# Altium schematic sheet In-Out.SchDoc
size A4; DocumentNumber: 7; SheetNumber: 7; SheetTotal: 7
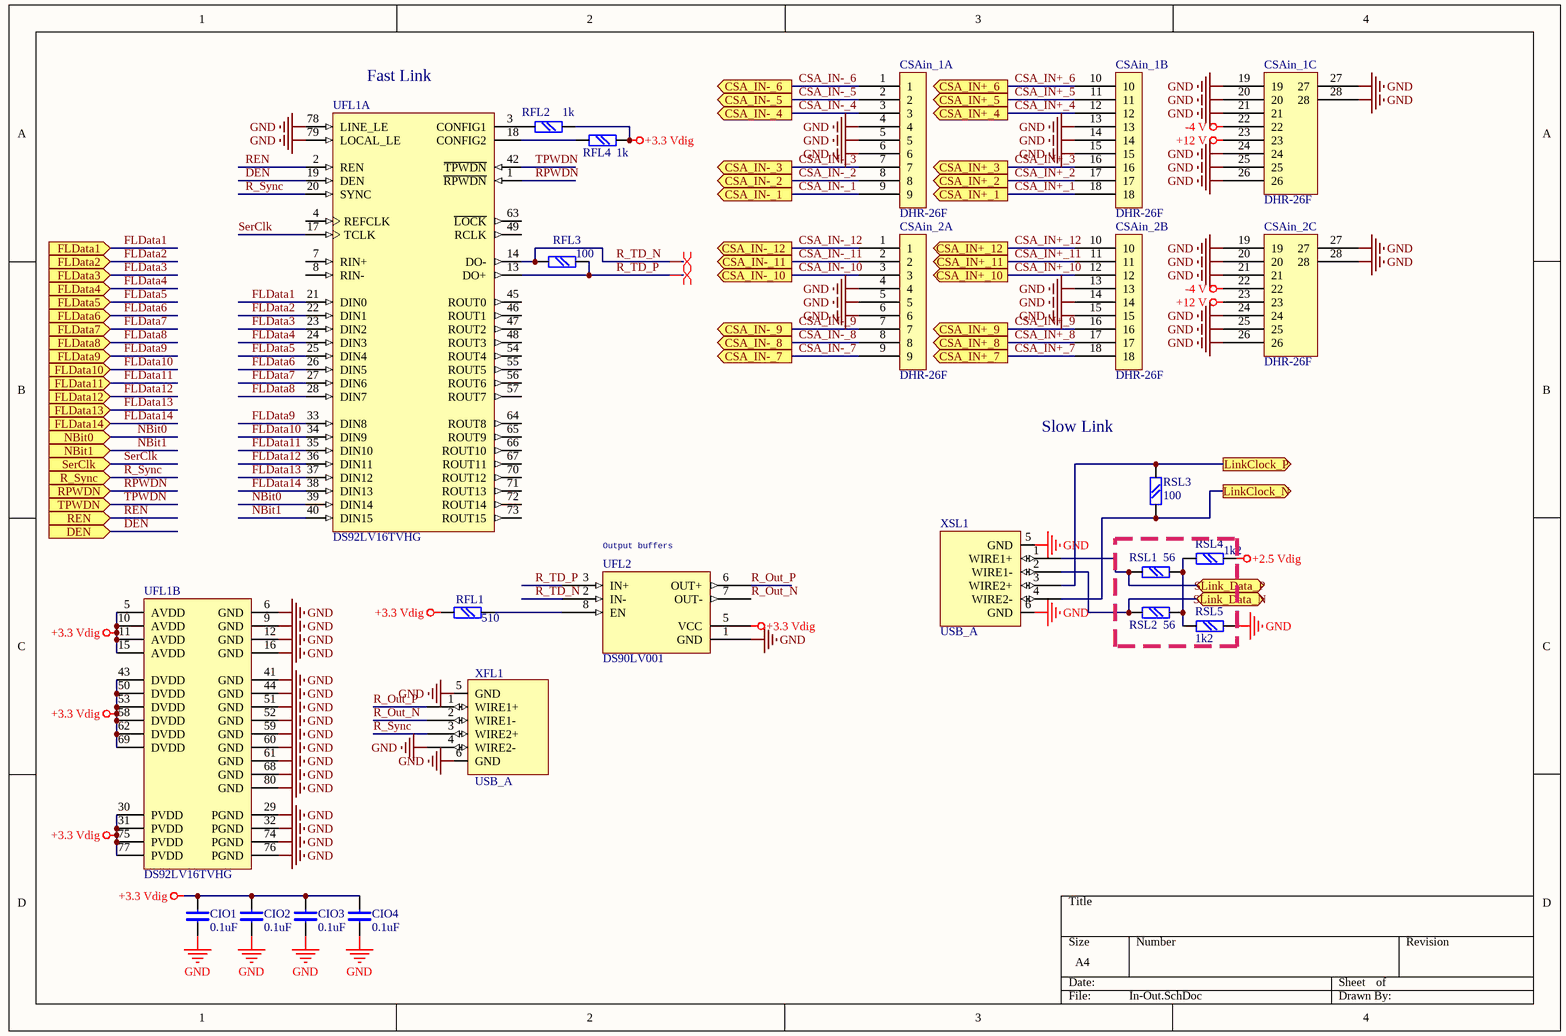
[diagram p0: In-Out.SchDoc]

## Parts
CIO1  0.1uF  [chip0603]
CIO2  0.1uF  [chip0603]
CIO3  0.1uF  [chip0603]
CIO4  0.1uF  [chip0603]
CSAin_1  DHR-26F  [DHR-F-26]  (parts A,B,C of 3)
CSAin_2  DHR-26F  [DHR-F-26]  (parts A,B,C of 3)
RFL1  510  [chip0603]
RFL2  1k  [chip0603]
RFL3  100  [chip0603]
RFL4  1k  [chip0603]
RSL1  56  [chip0603]
RSL2  56  [chip0603]
RSL3  100  [chip0603]
RSL4  1k2  [chip0603]
RSL5  1k2  [chip0603]
UFL1  DS92LV16TVHG  [VHG80A_N]  (parts A,B of 2)
UFL2  DS90LV001  [8SO200]
XFL1  USB_A  [USB2.5-2H4B]
XSL1  USB_A  [USB2.5-2H4B]

## Ports
CSA_IN+_1 (out), CSA_IN+_2 (out), CSA_IN+_3 (out), CSA_IN+_4 (out), CSA_IN+_5 (out), CSA_IN+_6 (out), CSA_IN+_7 (out), CSA_IN+_8 (out), CSA_IN+_9 (out), CSA_IN+_10 (out), CSA_IN+_11 (out), CSA_IN+_12 (out), CSA_IN-_1 (out), CSA_IN-_2 (out), CSA_IN-_3 (out), CSA_IN-_4 (out), CSA_IN-_5 (out), CSA_IN-_6 (out), CSA_IN-_7 (out), CSA_IN-_8 (out), CSA_IN-_9 (out), CSA_IN-_10 (out), CSA_IN-_11 (out), CSA_IN-_12 (out), DEN (in), FLData1 (in), FLData2 (in), FLData3 (in), FLData4 (in), FLData5 (in), FLData6 (in), FLData7 (in), FLData8 (in), FLData9 (in), FLData10 (in), FLData11 (in), FLData12 (in), FLData13 (in), FLData14 (in), LinkClock_N (out), LinkClock_P (out), NBit0 (in), NBit1 (in), R_Sync (in), REN (in), RPWDN (in), SerClk (in), SLink_Data_N (bidir), SLink_Data_P (bidir), TPWDN (in)

## Nets
+2.5 Vdig: RSL4.2
+3.3 Vdig: CIO1.2 CIO2.2 CIO3.2 CIO4.2 RFL1.1 RFL2.2 RFL4.2 UFL1.5(AVDD) UFL1.10(AVDD) UFL1.11(AVDD) UFL1.15(AVDD) UFL1.30(PVDD) UFL1.31(PVDD) UFL1.43(DVDD) UFL1.50(DVDD) UFL1.53(DVDD) UFL1.58(DVDD) UFL1.62(DVDD) UFL1.69(DVDD) UFL1.75(PVDD) UFL1.77(PVDD) UFL2.5(VCC)
+12 V: CSAin_1.23 CSAin_2.23
-4 V: CSAin_1.22 CSAin_2.22
GND: CIO1.1 CIO2.1 CIO3.1 CIO4.1 CSAin_1.4 CSAin_1.5 CSAin_1.6 CSAin_1.13 CSAin_1.14 CSAin_1.15 CSAin_1.19 CSAin_1.20 CSAin_1.21 CSAin_1.24 CSAin_1.25 CSAin_1.26 CSAin_1.27 CSAin_1.28 CSAin_2.4 CSAin_2.5 CSAin_2.6 CSAin_2.13 CSAin_2.14 CSAin_2.15 CSAin_2.19 CSAin_2.20 CSAin_2.21 CSAin_2.24 CSAin_2.25 CSAin_2.26 CSAin_2.27 CSAin_2.28 RSL5.1 UFL1.6(GND) UFL1.9(GND) UFL1.12(GND) UFL1.16(GND) UFL1.29(PGND) UFL1.32(PGND) UFL1.41(GND) UFL1.44(GND) UFL1.51(GND) UFL1.52(GND) UFL1.59(GND) UFL1.60(GND) UFL1.61(GND) UFL1.68(GND) UFL1.74(PGND) UFL1.76(PGND) UFL1.78(LINE_LE) UFL1.79(LOCAL_LE) UFL1.80(GND) UFL2.1(GND) XFL1.4(WIRE2-) XFL1.5(GND) XFL1.6(GND) XSL1.5(GND) XSL1.6(GND)
CSA_IN+_1: CSAin_1.18 ; port CSA_IN+_1
CSA_IN+_2: CSAin_1.17 ; port CSA_IN+_2
CSA_IN+_3: CSAin_1.16 ; port CSA_IN+_3
CSA_IN+_4: CSAin_1.12 ; port CSA_IN+_4
CSA_IN+_5: CSAin_1.11 ; port CSA_IN+_5
CSA_IN+_6: CSAin_1.10 ; port CSA_IN+_6
CSA_IN+_7: CSAin_2.18 ; port CSA_IN+_7
CSA_IN+_8: CSAin_2.17 ; port CSA_IN+_8
CSA_IN+_9: CSAin_2.16 ; port CSA_IN+_9
CSA_IN+_10: CSAin_2.12 ; port CSA_IN+_10
CSA_IN+_11: CSAin_2.11 ; port CSA_IN+_11
CSA_IN+_12: CSAin_2.10 ; port CSA_IN+_12
CSA_IN-_1: CSAin_1.9 ; port CSA_IN-_1
CSA_IN-_2: CSAin_1.8 ; port CSA_IN-_2
CSA_IN-_3: CSAin_1.7 ; port CSA_IN-_3
CSA_IN-_4: CSAin_1.3 ; port CSA_IN-_4
CSA_IN-_5: CSAin_1.2 ; port CSA_IN-_5
CSA_IN-_6: CSAin_1.1 ; port CSA_IN-_6
CSA_IN-_7: CSAin_2.9 ; port CSA_IN-_7
CSA_IN-_8: CSAin_2.8 ; port CSA_IN-_8
CSA_IN-_9: CSAin_2.7 ; port CSA_IN-_9
CSA_IN-_10: CSAin_2.3 ; port CSA_IN-_10
CSA_IN-_11: CSAin_2.2 ; port CSA_IN-_11
CSA_IN-_12: CSAin_2.1 ; port CSA_IN-_12
DEN: UFL1.19(DEN) ; port DEN
FLData1: UFL1.21(DIN0) ; port FLData1
FLData2: UFL1.22(DIN1) ; port FLData2
FLData3: UFL1.23(DIN2) ; port FLData3
FLData4: UFL1.24(DIN3) ; port FLData4
FLData5: UFL1.25(DIN4) ; port FLData5
FLData6: UFL1.26(DIN5) ; port FLData6
FLData7: UFL1.27(DIN6) ; port FLData7
FLData8: UFL1.28(DIN7) ; port FLData8
FLData9: UFL1.33(DIN8) ; port FLData9
FLData10: UFL1.34(DIN9) ; port FLData10
FLData11: UFL1.35(DIN10) ; port FLData11
FLData12: UFL1.36(DIN11) ; port FLData12
FLData13: UFL1.37(DIN12) ; port FLData13
FLData14: UFL1.38(DIN13) ; port FLData14
LinkClock_N: RSL3.1 XSL1.4(WIRE2-) ; port LinkClock_N
LinkClock_P: RSL3.2 XSL1.3(WIRE2+) ; port LinkClock_P
NBit0: UFL1.39(DIN14) ; port NBit0
NBit1: UFL1.40(DIN15) ; port NBit1
R_Out_N: UFL2.7(OUT-) XFL1.2(WIRE1-)
R_Out_P: UFL2.6(OUT+) XFL1.1(WIRE1+)
R_Sync: UFL1.20(SYNC) XFL1.3(WIRE2+) ; port R_Sync
R_TD_N: RFL3.1 UFL1.14(DO-) UFL2.2(IN-)
R_TD_P: RFL3.2 UFL1.13(DO+) UFL2.3(IN+)
REN: UFL1.2(REN) ; port REN
RPWDN: UFL1.1(~{RPWDN}) ; port RPWDN
SerClk: UFL1.17(TCLK) ; port SerClk
SLink_Data_N: RSL2.2 XSL1.2(WIRE1-) ; port SLink_Data_N
SLink_Data_P: RSL1.2 XSL1.1(WIRE1+) ; port SLink_Data_P
TPWDN: UFL1.42(~{TPWDN}) ; port TPWDN
NetRFL1_2: RFL1.2 UFL2.8(EN)
NetRFL2_1: RFL2.1 UFL1.3(CONFIG1)
NetRFL4_1: RFL4.1 UFL1.18(CONFIG2)
NetRSL1_1: RSL1.1 RSL2.1 RSL4.1 RSL5.2

Not connected (* = marked no-connect by the designer): UFL1 4(REFCLK) 7(RIN+) 8(RIN-) 45(ROUT0) 46(ROUT1) 47(ROUT2) 48(ROUT3) 49(RCLK) 54(ROUT4) 55(ROUT5) 56(ROUT6) 57(ROUT7) 63(~{LOCK}) 64(ROUT8) 65(ROUT9) 66(ROUT10) 67(ROUT11) 70(ROUT12) 71(ROUT13) 72(ROUT14) 73(ROUT15)

## Layout directives
differential pair: R_TD_N, R_TD_P

## Notes on the sheet
- (near UFL1) Fast Link
- Slow Link
- (near UFL2) Output buffers

## Library data of the parts
CIO1-CIO4 = C: Text Field1: 20; Text Field2: 10
RFL1-RFL4 RSL1-RSL5 = R: Text Field1: 20; Text Field2: 20
UFL1 = DS92LV16TVHG: 16-Bit Bus LVDS Serializer/Deserializer - 25 - 80 MHz, 80-pin LQFP; Manufacturer: National Semiconductor; PackageTopMarking: NSUZXYTTE#*DS92LV16TVHG*BBBBB; PowerWise: N; CompType: Interface IC; Published: 4-Dec-2008; DatasheetVersion: Feb-2002; PackageVersion: revE, Feb-2005; PackageReference: VHG80A; Publisher: Altium Limited; PackageDescription: LQFP, Jedec, Metric, 12 x 12 x 1.4mm, 80 Lead, 0.5mm Pitch; Supplier 1: Farnell; Supplier Part Number 1: 8206848; PartNumber: DS92LV16TVHG; RoHS: N; PinCount: 80; Code_JEDEC: MS-026-BDD; ComponentLink1Description: DS92LV16 Datasheet; ComponentLink1URL: http://www.national.com/ds/DS/DS92LV16.pdf; ComponentLink2Description: DS92LV16 Web Page; ComponentLink2URL: http://www.national.com/pf/DS/DS92LV16.html; ComponentLink3Description: VHG80A Package Page; ComponentLink3URL: http://www.national.com/packaging/folders/vhg80a.html
UFL2 = DS90LV001: Text Field1: 80; Text Field2: 40
XFL1 XSL1 = USB_A: Text Field1: 60; Text Field2: 70